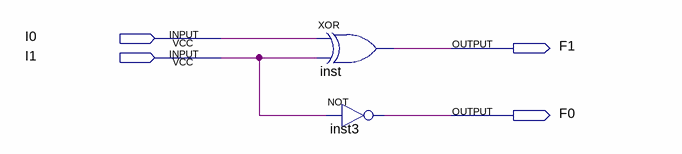
[diagram p0: schematic sheet]
// Quartus schematic Resigter.bdf as structural Verilog: 2 symbols, 4 pins
module Resigter (
  input  I0,
  input  I1,
  output F1,
  output F0
);

  xor inst (F1, I0, I1);
  not inst3 (F0, I1);
endmodule
